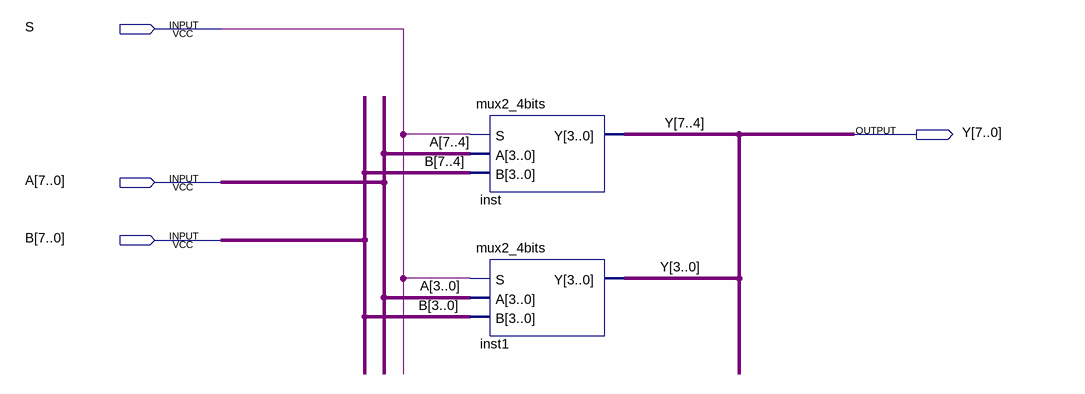
[diagram p0: schematic sheet]
// Quartus schematic mux2_8bits.bdf as structural Verilog: 2 symbols, 4 pins
module mux2_8bits (
  input  S,
  input  [7:0] A,
  input  [7:0] B,
  output [7:0] Y
);

  mux2_4bits inst (.S(S), .A(A[7:4]), .B(B[7:4]), .Y(Y[7:4]));
  mux2_4bits inst1 (.S(S), .A(A[3:0]), .B(B[3:0]), .Y(Y[3:0]));
endmodule
